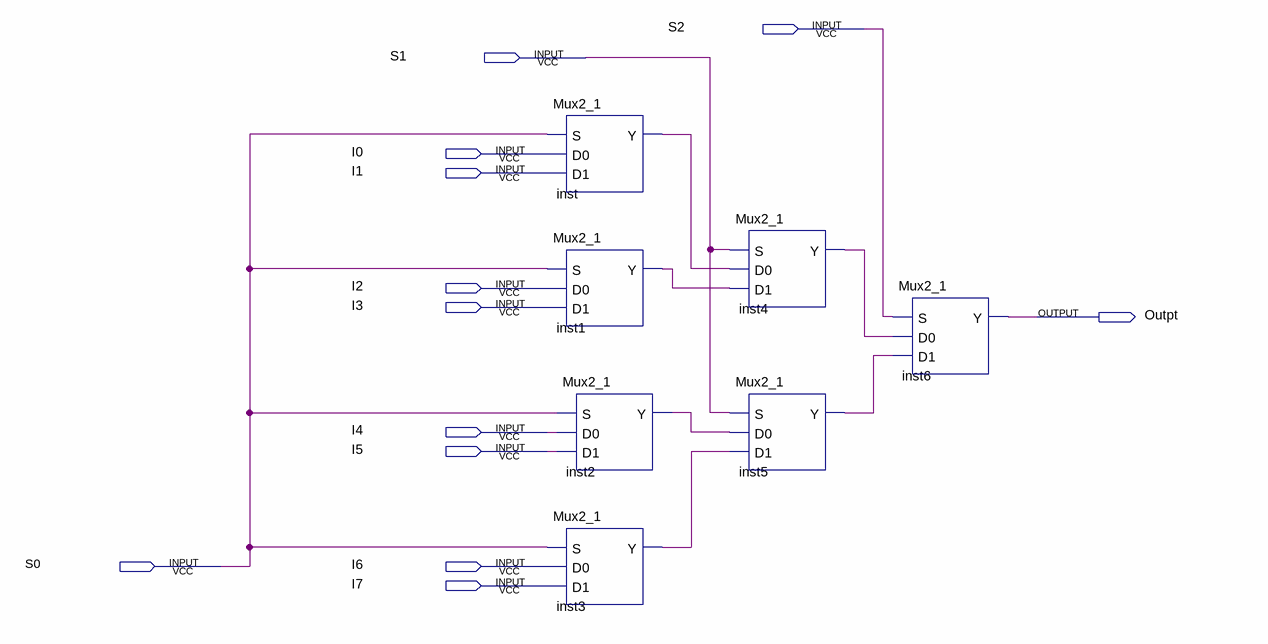
[diagram p0: schematic sheet]
// Quartus schematic Mux8_1.bdf as structural Verilog: 7 symbols, 12 pins
module Mux8_1 (
  input  S2,
  input  S1,
  input  I0,
  input  I1,
  input  I2,
  input  I3,
  input  I4,
  input  I5,
  input  S0,
  input  I6,
  input  I7,
  output Outpt
);

  wire inst1_y, inst2_y, inst3_y, inst4_y, inst5_y, inst_y;

  Mux2_1 inst (.S(S0), .D0(I0), .D1(I1), .Y(inst_y));
  Mux2_1 inst1 (.S(S0), .D0(I2), .D1(I3), .Y(inst1_y));
  Mux2_1 inst2 (.S(S0), .D0(I4), .D1(I5), .Y(inst2_y));
  Mux2_1 inst3 (.S(S0), .D0(I6), .D1(I7), .Y(inst3_y));
  Mux2_1 inst4 (.S(S1), .D0(inst_y), .D1(inst1_y), .Y(inst4_y));
  Mux2_1 inst5 (.S(S1), .D0(inst2_y), .D1(inst3_y), .Y(inst5_y));
  Mux2_1 inst6 (.S(S2), .D0(inst4_y), .D1(inst5_y), .Y(Outpt));
endmodule
